# Altium schematic sheet ADC_4CH.SchDoc: ADC
size 420 x 297 mm; EDA_Number: Sinara; Projet: BaseMod; Author: G.Kasprowicz; CompanyName: WUT ISE; DrawnBy: G.Kasprowicz; Organization: WUT ISE; Address1: PW ISE; Address2: Nowowiejska 15/19 00-665 Warsaw; Address3: gkasprow@gmail.com; DocumentNumber: 3; Revision: 1.0; SheetNumber: 3; SheetTotal: 7; ModifiedBy: -; CheckedDate: -; Title2: & reference; DivGrp: WUT ISE; Designer: G.Kasprowicz; ModifiedDate: -; ProjectName: Sensor Box
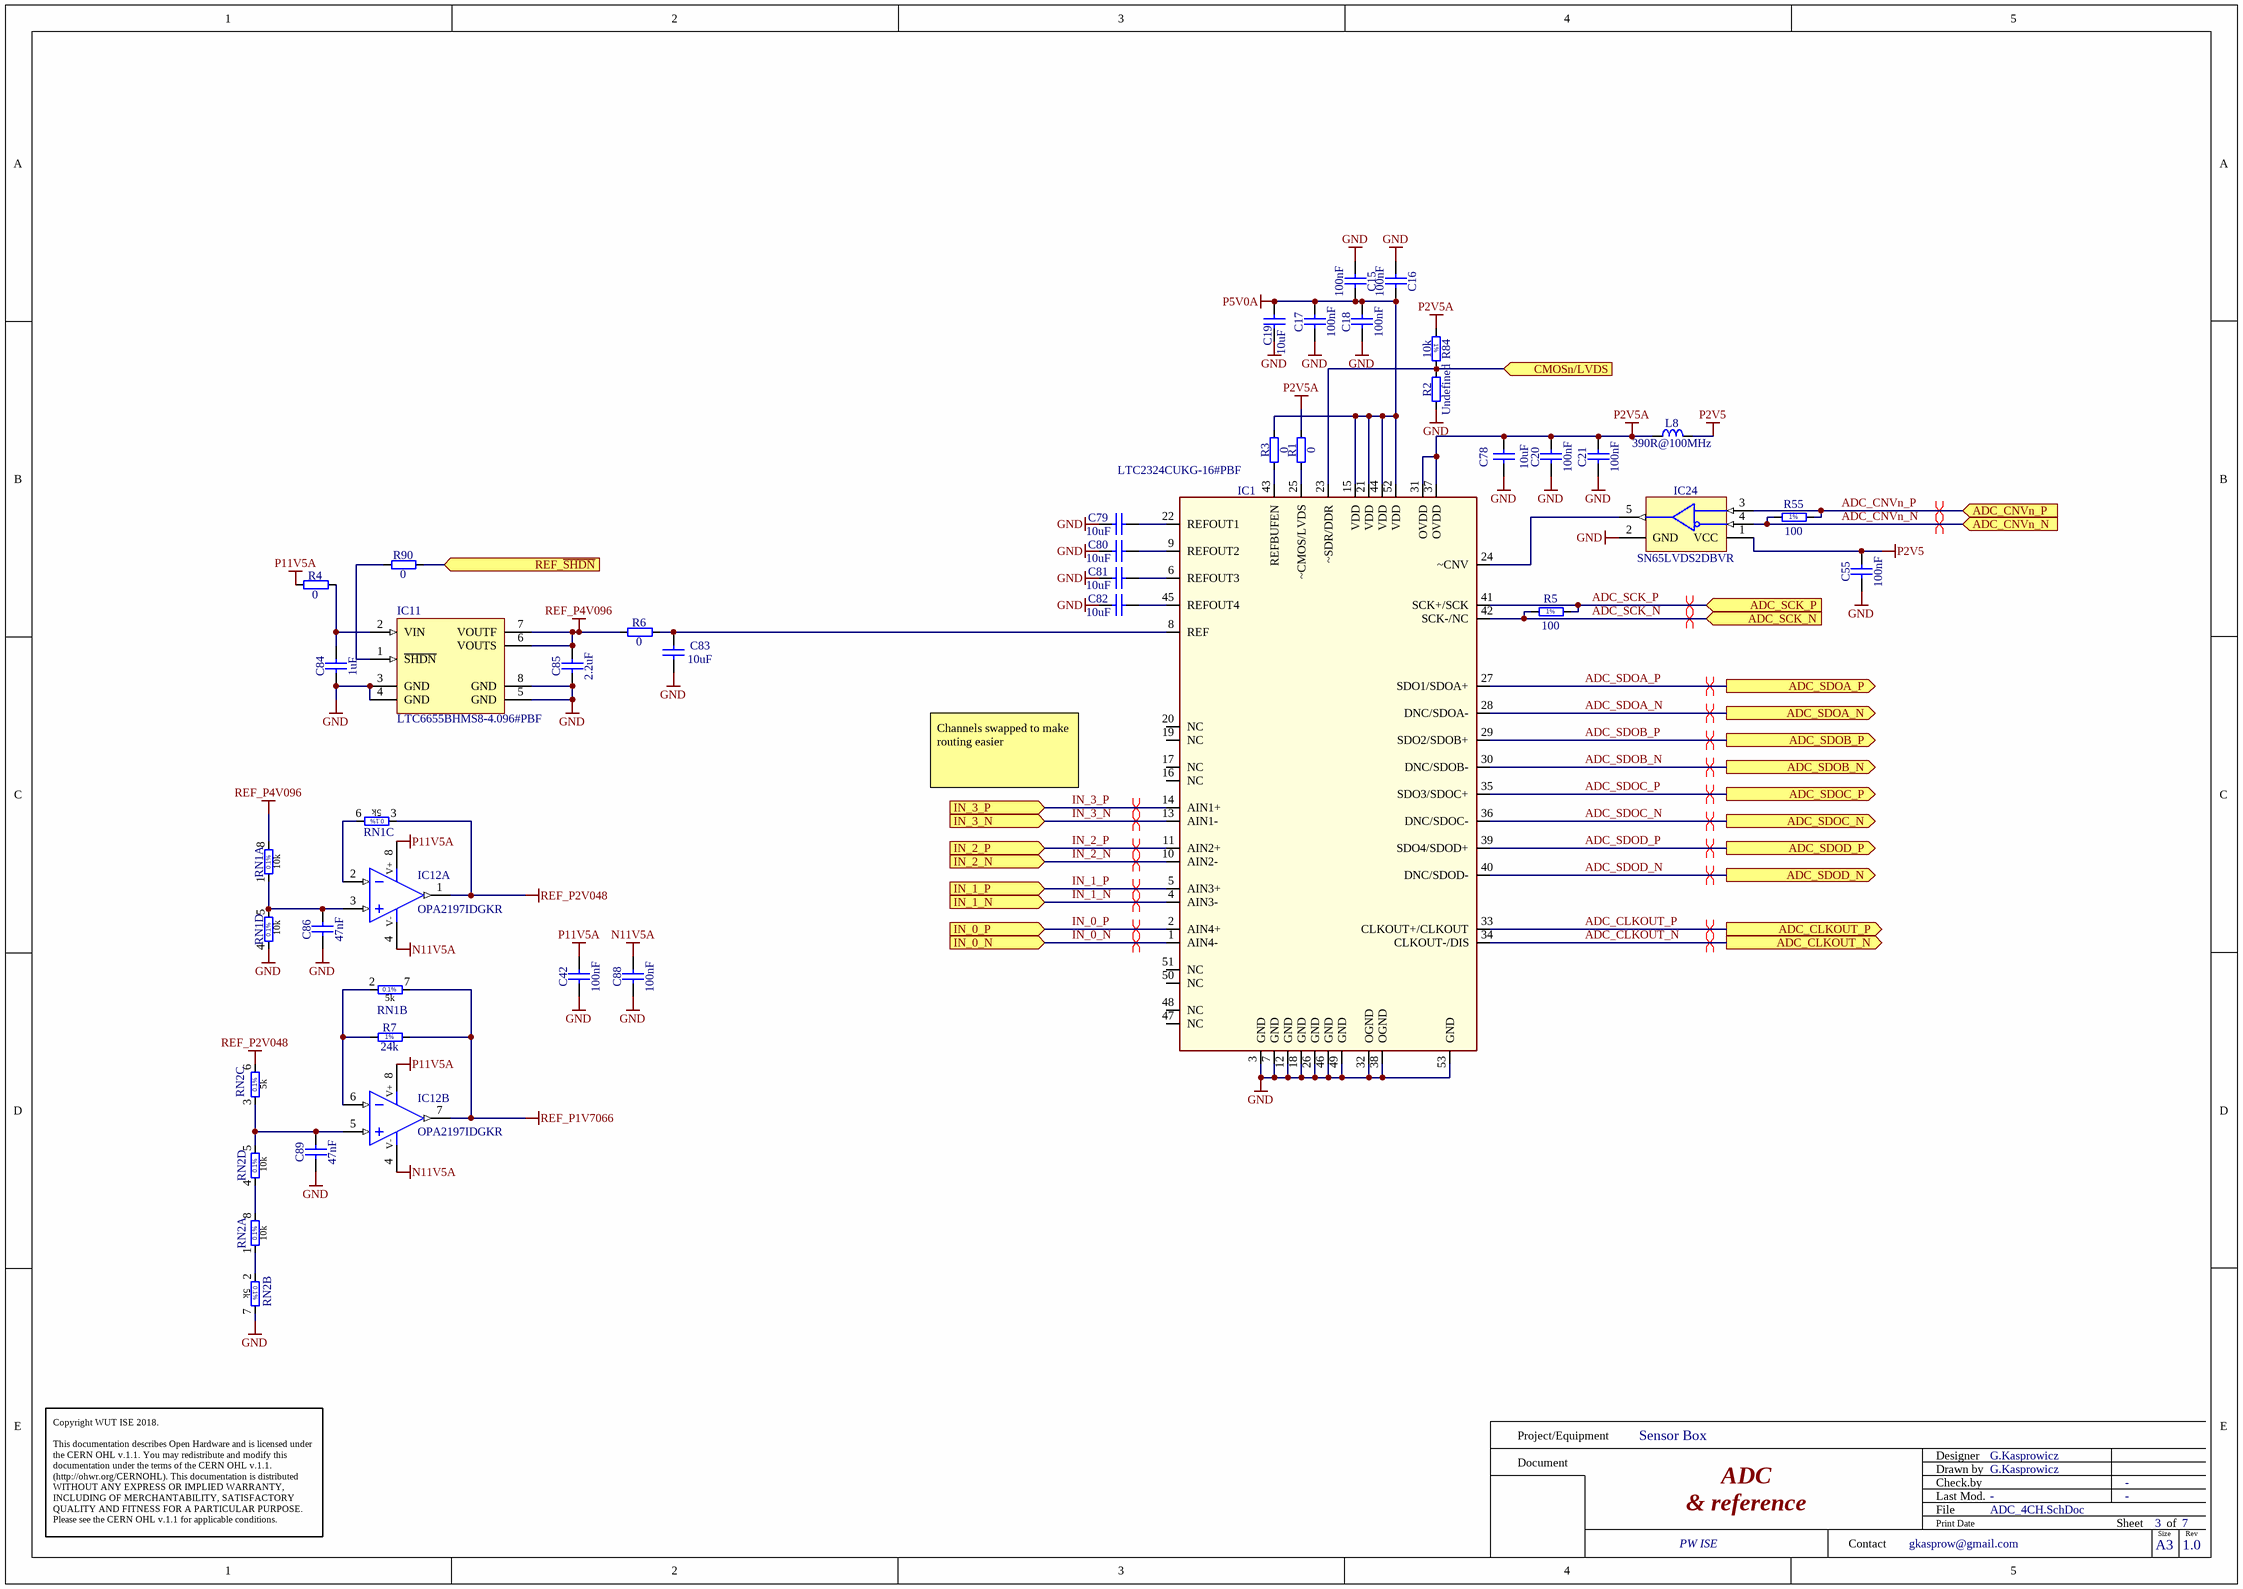
[diagram p0: ADC_4CH.SchDoc]

## Parts
C15  100nF  [CAPC1608X87N]
C16  100nF  [CAPC1608X87N]
C17  100nF  [CAPC1608X87N]
C18  100nF  [CAPC1608X87N]
C19  10uF  [CAPC2012X95N]
C20  100nF  [CAPC1608X87N]
C21  100nF  [CAPC1608X87N]
C42  100nF  [CAPC1005X55N]
C55  100nF  [CAPC1608X87N]
C78  10uF  [CAPC2012X95N]
C79  10uF  [CAPC2012X95N]
C80  10uF  [CAPC2012X95N]
C81  10uF  [CAPC2012X95N]
C82  10uF  [CAPC2012X95N]
C83  10uF  [CAPC2012X95N]
C84  1uF  [CAPC1608X87N]
C85  2.2uF  [CAPC1608X87N]
C86  47nF  [CAPC2012X135N]
C88  100nF  [CAPC1005X55N]
C89  47nF  [CAPC2012X135N]
IC1  LTC2324CUKG-16#PBF  [QFN50P700X800X80_HS-53M]
IC11  LTC6655BHMS8-4.096#PBF  [SOP65P490X110-8N]
IC12  OPA2197IDGKR  [SOP65P490X110-8N]  (parts A,B of 2)
IC24  SN65LVDS2DBVR  [SOT95P280X145-5N]
L8  390R@100MHz  [INDC1608X95N]
R1  0  [RESC1005X40N]
R2  Undefined  [RESC1005X40N]
R3  0  [RESC1005X40N]
R4  0  [RESC1005X40N]
R5  100  [RESC1005X40N]
R6  0  [RESC1005X40N]
R7  24k  [RESC1608X55N]
R55  100  [RESC1005X40N]
R84  10k  [RESC1005X40N]
R90  0  [RESC1005X40N]
RN1  10k 5K 5K 10K  [SOIC127P600X175-8N]  (value not drawn)  (parts A,B,C,D of 4)
RN2  10k 5K 5K 10K  [SOIC127P600X175-8N]  (value not drawn)  (parts A,B,C,D of 4)

## Ports
ADC_CLKOUT_N (out), ADC_CLKOUT_P (out), ADC_CNVn_N (in), ADC_CNVn_P (in), ADC_SCK_N (in), ADC_SCK_P (in), ADC_SDOA_N (out), ADC_SDOA_P (out), ADC_SDOB_N (out), ADC_SDOB_P (out), ADC_SDOC_N (out), ADC_SDOC_P (out), ADC_SDOD_N (out), ADC_SDOD_P (out), CMOSn/LVDS (in), IN_0_N (in), IN_0_P (in), IN_1_N (in), IN_1_P (in), IN_2_N (in), IN_2_P (in), IN_3_N (in), IN_3_P (in), REF_~{SHDN} (in)

## Nets
GND: C15.1 C16.1 C17.1 C18.1 C19.1 C20.1 C21.1 C42.1 C55.1 C78.1 C79.1 C80.1 C81.1 C82.1 C83.1 C84.1 C85.1 C86.1 C88.1 C89.1 IC1.3(GND) IC1.7(GND) IC1.12(GND) IC1.18(GND) IC1.26(GND) IC1.32(OGND) IC1.38(OGND) IC1.46(GND) IC1.49(GND) IC1.53(GND) IC11.3(GND) IC11.4(GND) IC11.5(GND) IC11.8(GND) IC24.2(GND) R2.1 RN1.4 RN2.7
N11V5A: C88.2 IC12.4(V-)
P2V5: C55.2 IC24.1(VCC) L8.2
P2V5A: C20.2 C21.2 C78.2 IC1.31(OVDD) IC1.37(OVDD) L8.1 R1.2 R84.1
P5V0A: C15.2 C16.2 C17.2 C18.2 C19.2 IC1.15(VDD) IC1.21(VDD) IC1.44(VDD) IC1.52(VDD) R3.2
P11V5A: C42.2 IC12.8(V+) R4.1
REF_P1V7066: IC12.7(OUT) R7.2 RN1.7
REF_P2V048: IC12.1(OUT) RN1.3 RN2.6
REF_P4V096: C85.2 IC11.6(VOUTS) IC11.7(VOUTF) R6.1 RN1.8
ADC_CLKOUT_N: IC1.34(CLKOUT-/DIS) ; port ADC_CLKOUT_N
ADC_CLKOUT_P: IC1.33(CLKOUT+/CLKOUT) ; port ADC_CLKOUT_P
ADC_CNVn_N: IC24.4(B) R55.1 ; port ADC_CNVn_N
ADC_CNVn_P: IC24.3(A) R55.2 ; port ADC_CNVn_P
ADC_SCK_N: IC1.42(SCK-/NC) R5.1 ; port ADC_SCK_N
ADC_SCK_P: IC1.41(SCK+/SCK) R5.2 ; port ADC_SCK_P
ADC_SDOA_N: IC1.28(DNC/SDOA-) ; port ADC_SDOA_N
ADC_SDOA_P: IC1.27(SDO1/SDOA+) ; port ADC_SDOA_P
ADC_SDOB_N: IC1.30(DNC/SDOB-) ; port ADC_SDOB_N
ADC_SDOB_P: IC1.29(SDO2/SDOB+) ; port ADC_SDOB_P
ADC_SDOC_N: IC1.36(DNC/SDOC-) ; port ADC_SDOC_N
ADC_SDOC_P: IC1.35(SDO3/SDOC+) ; port ADC_SDOC_P
ADC_SDOD_N: IC1.40(DNC/SDOD-) ; port ADC_SDOD_N
ADC_SDOD_P: IC1.39(SDO4/SDOD+) ; port ADC_SDOD_P
CMOSn/LVDS: IC1.23(~SDR/DDR) R2.2 R84.2 ; port CMOSn/LVDS
IN_0_N: IC1.1(AIN4-) ; port IN_0_N
IN_0_P: IC1.2(AIN4+) ; port IN_0_P
IN_1_N: IC1.4(AIN3-) ; port IN_1_N
IN_1_P: IC1.5(AIN3+) ; port IN_1_P
IN_2_N: IC1.10(AIN2-) ; port IN_2_N
IN_2_P: IC1.11(AIN2+) ; port IN_2_P
IN_3_N: IC1.13(AIN1-) ; port IN_3_N
IN_3_P: IC1.14(AIN1+) ; port IN_3_P
REF_~{SHDN}: R90.2 ; port REF_~{SHDN}
NetC79_2: C79.2 IC1.22(REFOUT1)
NetC80_2: C80.2 IC1.9(REFOUT2)
NetC81_2: C81.2 IC1.6(REFOUT3)
NetC82_2: C82.2 IC1.45(REFOUT4)
NetC83_2: C83.2 IC1.8(REF) R6.2
NetC84_2: C84.2 IC11.2(VIN) R4.2
NetC86_2: C86.2 IC12.3(IN+) RN1.1 RN1.5
NetC89_2: C89.2 IC12.5(IN+) RN2.3 RN2.5
NetIC1_24: IC1.24(~CNV) IC24.5(R)
NetIC1_25: IC1.25(~CMOS/LVDS) R1.1
NetIC1_43: IC1.43(REFBUFEN) R3.1
NetIC11_1: IC11.1(~{SHDN}) R90.1
NetIC12_2: IC12.2(IN-) RN1.6
NetIC12_6: IC12.6(IN-) R7.1 RN1.2
NetRN2_1: RN2.1 RN2.2
NetRN2_4: RN2.4 RN2.8

Not connected (* = marked no-connect by the designer): IC1 16(NC) 17(NC) 19(NC) 20(NC) 47(NC) 48(NC) 50(NC) 51(NC)

## Layout directives
differential pair: ADC_CLKOUT_N, ADC_CLKOUT_P, ADC_CNVn_N, ADC_CNVn_P, ADC_SCK_N, ADC_SCK_P, ADC_SDOA_N, ADC_SDOA_P, ADC_SDOB_N, ADC_SDOB_P, ADC_SDOC_N, ADC_SDOC_P, ADC_SDOD_N, ADC_SDOD_P, IN_0_N, IN_0_P, IN_1_N, IN_1_P, IN_2_N, IN_2_P, IN_3_N, IN_3_P

## Notes on the sheet
- Channels swapped to make routing easier
- Project/Equipment
- Document
- Designer
- Drawn by
- Check.by
- Copyright WUT ISE 2018.
  This documentation describes Open Hardware and is licensed under the CERN OHL v.1.1. You may redistribute and modify this documentation under the terms of the CERN OHL v.1.1. (http://ohwr.org/CERNOHL). This documentation is distributed WITHOUT ANY EXPRESS OR IMPLIED WARRANTY, INCLUDING OF MERCHANTABILITY, SATISFACTORY QUALITY AND FITNESS FOR A PARTICULAR PURPOSE. Please see the CERN OHL v.1.1 for applicable conditions.
- Contact
- File
- Last Mod.
- Print Date
- Sheet
- Size
- A3
- of
- Rev
- (in symbol R0402_10K_1%_0.0625W_100PPM) 1%
- (in symbol R0402_100R_1%_0.1W_100PPM) 1%
- (in symbol R0603_24K_1%_0.1W_100PPM) 1%
- (in symbol RN_10K_5K_VISHAY_AORN2-1AT3, part A) 10k
- (in symbol RN_10K_5K_VISHAY_AORN2-1AT3, part B) 5k
- (in symbol RN_10K_5K_VISHAY_AORN2-1AT3, part C) 5k
- (in symbol RN_10K_5K_VISHAY_AORN2-1AT3, part D) 10k

## Library data of the parts
C15-C18 C20 C21 C55 = CC0603_100NF_50V_10%_X7R: Non-polarised capacitor; Part Description: SMD Multilayer Chip Ceramic Capacitor; Manufacturer: GENERIC; Manufacturer1 Part Number: 223858615649; Voltage: 50V; TC: X7R; Tolerance: ±10%; Part Number: CC0603_100NF_50V_10%_X7R; Component Kind: Standard; Component Type: Standard; Pin Count: 2; Value: 100nF; Status: Preferred; Manufacturer Part Number: CC0603_100NF_50V_10%_X7R; Case: 0603; Mounted: Yes; Socket: No; SMD: Yes; Sense: No; Manufacturer1 Example: PHYCOMP; Manufacturer1 ComponentHeight: 0.87mm; HelpURL: \\cern.ch\dfs\Applications\Altium\Datasheets\CC0603_X7R_PHYCOMP.pdf; Author: CERN DEM JLC; CreateDate: 03.12.2007; LatestRevisionDate: 03.12.2007
C19 C78-C83 = CC0805_10UF_25V_10%_X5R: Non-polarised capacitor; Part Description: SMD Multilayer Chip Ceramic Capacitor; Manufacturer: GENERIC; Manufacturer1 Part Number: GRM219R61E106KA12D; Voltage: 25V; TC: X5R; Tolerance: ±10%; Part Number: CC0805_10UF_25V_10%_X5R; Component Kind: Standard; Component Type: Standard; Pin Count: 2; Value: 10uF; Status: Preferred; Manufacturer Part Number: CC0805_10UF_25V_10%_X5R; Case: 0805; Mounted: Yes; Socket: No; SMD: Yes; Sense: No; Manufacturer1 Example: MURATA; Manufacturer1 ComponentHeight: 0.95mm; HelpURL: \\cern.ch\dfs\Applications\Altium\Datasheets\CC0805_X5R_MURATA_GRM.pdf; Author: CERN DEM JLC; CreateDate: 25.10.2012; LatestRevisionDate: 06.09.2016
C42 C88 = CC0402_100NF_16V_10%_X5R: Non-polarised capacitor; Part Description: SMD Multilayer Chip Ceramic Capacitor; Manufacturer: GENERIC; Manufacturer1 Part Number: GRM155R61C104KA88D; Voltage: 16V; TC: X5R; Tolerance: ±10%; Part Number: CC0402_100NF_16V_10%_X5R; Component Kind: Standard; Component Type: Standard; Pin Count: 2; Value: 100nF; Status: None; Manufacturer Part Number: CC0402_100NF_16V_10%_X5R; Case: 0402; Mounted: Yes; Socket: No; SMD: Yes; Sense: No; Manufacturer1 Example: MURATA; Manufacturer1 ComponentHeight: 0.55mm; HelpURL: \\cern.ch\dfs\Applications\Altium\Datasheets\CC0402_X5R_MURATA_GRM.pdf; Author: CERN DEM JLC; CreateDate: 10.12.2013; LatestRevisionDate: 10.12.2013
C84 = CC0603_1UF_25V_10%_X7R: Non-polarised capacitor; Part Description: SMD Multilayer Chip Ceramic Capacitor; Manufacturer: GENERIC; Manufacturer1 Part Number: GRM188R71E105KA12D; Voltage: 25V; TC: X7R; Tolerance: ±10%; Part Number: CC0603_1UF_25V_10%_X7R; Component Kind: Standard; Component Type: Standard; Pin Count: 2; Value: 1uF; Status: None; Manufacturer Part Number: CC0603_1UF_25V_10%_X7R; Case: 0603; Mounted: Yes; Socket: No; SMD: Yes; Sense: No; Manufacturer1 Example: MURATA; Manufacturer1 ComponentHeight: 0.9mm; HelpURL: \\cern.ch\dfs\Applications\Altium\Datasheets\CC0603_X7R_MURATA.pdf; Author: CERN DEM JLC; CreateDate: 18.01.2011; LatestRevisionDate: 18.01.2011
C85 = CC0603_2.2UF_16V_10%_X5R: Non-polarised capacitor; Part Description: SMD Multilayer Chip Ceramic Capacitor; Manufacturer: GENERIC; Manufacturer1 Part Number: CC0603KRX5R7BB225; Voltage: 16V; TC: X5R; Tolerance: ±10%; Part Number: CC0603_2.2UF_16V_10%_X5R; Component Kind: Standard; Component Type: Standard; Pin Count: 2; Value: 2.2uF; Status: Preferred; Manufacturer Part Number: CC0603_2.2UF_16V_10%_X5R; Case: 0603; Mounted: Yes; Socket: No; SMD: Yes; Sense: No; Manufacturer1 Example: YAGEO; Manufacturer1 ComponentHeight: 0.9mm; HelpURL: \\cern.ch\dfs\Applications\Altium\Datasheets\CC0805_X5R_PHYCOMP_HC.pdf; Author: CERN DEM JLC; CreateDate: 28.04.2011; LatestRevisionDate: 28.04.2011
C86 C89 = CC0805_47NF_25V_5%_C0G: Non-polarised capacitor; Part Description: SMD Multilayer Chip Ceramic Capacitor; Manufacturer: GENERIC; Manufacturer1 Part Number: C0805C473J3GACTU; Voltage: 25V; TC: C0G/NP0; Tolerance: ±5%; Part Number: CC0805_47NF_25V_5%_C0G; Component Kind: Standard; Component Type: Standard; Pin Count: 2; Value: 47nF; Status: None; Manufacturer Part Number: CC0805_47NF_25V_5%_C0G; Case: 0805; Mounted: Yes; Socket: No; SMD: Yes; Sense: No; Manufacturer1 Example: KEMET; Manufacturer1 ComponentHeight: 1.4mm; HelpURL: \\cern.ch\dfs\Applications\Altium\Datasheets\CC0805_C0G_KEMET_(Commercial Grade).pdf; Author: CERN DEM JLC; CreateDate: 18.01.2011; LatestRevisionDate: 18.01.2011
IC1 = ADC_LTC2324CUKG-16: Quad, 16-Bit, 2Msps/Ch  Simultaneous Sampling ADC; Manufacturer: LINEAR TECHNOLOGY; PressFit: No; Bonding: No; Part Number: LTC2324CUKG-16#PBF; Component Kind: Standard; Component Type: Standard; Device: LTC2324CUKG-16#PBF; PackageDescription: QFN, 52-Leads, Body 7.00x8.00mm, Pitch 0.50mm, Thermal Pad 5.41x6.40mm, IPC Low Density; Part Description: Quad, 16-Bit, 2Msps/Ch  Simultaneous Sampling ADC; Manufacturer Part Number: LTC2324CUKG-16#PBF; Pin Count: 48; Case: QFP48; Mounted: Yes; Socket: No; SMD: Yes; Sense: No; ComponentHeight: 0.8; Author: GK; HelpURL: \\cern.ch\dfs\Applications\Altium\Datasheets\LTC2335CLX-18#PBF.pdf; CreateDate: 10.01.2017; LatestRevisionDate: 10.01.2017
IC11 = REF_LTC6655: 0.25ppm Noise, Low Drift Precision Buffered Voltage Reference; Part Description: 4.096V, 0.25ppm Noise, Low Drift Precision Buffered Voltage Reference; Manufacturer: LINEAR TECHNOLOGY; PressFit: No; Bonding: No; Part Number: LTC6655BHMS8-4.096#PBF; Component Kind: Standard; Component Type: Standard; Device: LTC6655BHMS8-4.096#PBF; PackageDescription: SOP, 8-Leads, Body 3.1x3.1mm (max), Pitch 0.65mm, IPC Medium Density; Manufacturer Part Number: LTC6655BHMS8-4.096#PBF; Pin Count: 8; Case: SSOP8; Mounted: Yes; Socket: No; SMD: Yes; Sense: No; ComponentHeight: 1.1mm; HelpURL: \\cern.ch\dfs\Applications\Altium\Datasheets\LTC6655BHMS8-5#PBF.pdf; Author: GK; CreateDate: 07.06.2012; LatestRevisionDate: 07.06.2012
IC12 = OA_OPA2197IDGKR: 36-V, Precision, Rail-to-Rail Input Output, Low Offset Voltage Op Amp 8-VSSOP; Part Description: High-Precision, Low-Noise, Rail-to-Rail Output,10-MHz Op Amp; Manufacturer: TEXAS INSTRUMENTS; PressFit: No; Bonding: No; Part Number: OPA2197IDGKR; Component Kind: Standard; Component Type: Standard; Device: OPA2197IDGKR; PackageDescription: SOP, 0.65mm pitch; 8 pin, 3.00mm W X 3.00mm L X 1.10mm H body, IPC Medium Density; Manufacturer Part Number: OPA2197IDGKR; Pin Count: 8; Case: MSOP8; Mounted: Yes; Socket: No; SMD: Yes; Sense: No; ComponentHeight: 1.1mm; Author: GK; HelpURL: \\cern.ch\dfs\Applications\Altium\Datasheets\OPA2140AIDGK.pdf; CreateDate: 20.04.2017; LatestRevisionDate: 20.04.2017
IC24 = SN65LVDS2DBVR: High-Speed Differential Line Receiver; Manufacturer: TEXAS INSTRUMENTS; PressFit: No; Bonding: No; Part Number: SN65LVDS2DBVR; Component Kind: Standard; Component Type: Standard; Device: SN65LVDS2DBVR; PackageDescription: SOT, 0.95mm pitch; 5 pin, 1.60mm W X 2.90mm L X 1.45mm H body, IPC Medium Density; Part Description: High-Speed Differential Line Receiver; Manufacturer Part Number: SN65LVDS2DBVR; Pin Count: 5; Case: SOT23-5; Mounted: Yes; Socket: No; SMD: Yes; Sense: No; ComponentHeight: 1.45mm; Author: CERN DEM JLC; HelpURL: \\cern.ch\dfs\Applications\Altium\Datasheets\SN65LVDS2DBVR.pdf; CreateDate: 03.03.2011; LatestRevisionDate: 22.09.2011
L8 = IND0603_TDK_MPZ1608R391A: Inductor; Part Description: SMT Chip Bead for Power Line; Manufacturer: TDK; Power: 1.2A; Resistance: 0.12R; Tolerance: ±25%; Part Number: IND0603_TDK_MPZ1608R391A; Component Kind: Standard; Component Type: Standard; Pin Count: 2; Value: 390R@100MHz; Status: None; Manufacturer Part Number: MPZ1608R391A; Case: 0603; Mounted: Yes; Socket: No; SMD: Yes; Sense: No; ComponentHeight: 0.95mm; HelpURL: \\cern.ch\dfs\Applications\Altium\Datasheets\IND0603_TDK_MPZ1608.pdf; Author: CERN DEM JLC; CreateDate: 2009-12-02; LatestRevisionDate: 2009-12-02
R1 R3 R4 R6 R90 = R0402_0R_JUMPER: Resistor; Part Description: 1A (0.05R Max DC Resistance) Zero Ohm Jumper; Manufacturer: GENERIC; Manufacturer1 Part Number: 232270591001L; Part Number: R0402_0R_JUMPER; Component Kind: Standard; Component Type: Standard; Pin Count: 2; Value: 0; Status: Not recommended; Manufacturer Part Number: R0402_0R_JUMPER; Case: 0402; Mounted: Yes; Sense: No; Socket: No; SMD: Yes; Manufacturer1 Example: YAGEO PHYCOMP; Manufacturer1 ComponentHeight: 0.4mm; HelpURL: \\cern.ch\dfs\Applications\Altium\Datasheets\R0402_Phycomp_RC0402.pdf; Author: CERN DEM JLC; CreateDate: 03.12.2007; LatestRevisionDate: 17.10.2012
R2 = R0402_NO-VALUE: Resistor; Part Description: Reserved Footprint For a 0402 (1005) Chip Resistor; PressFit: No; Mounted: No; Part Number: R0402_NO-VALUE; Component Kind: Standard; Component Type: Standard; Pin Count: 2; Value: Undefined; Status: None; Manufacturer: Undefined; Manufacturer Part Number: R0402_NO-VALUE; Case: 0402; Sense: No; Socket: No; SMD: Yes; Manufacturer1 Example: Undefined; Manufacturer1 Part Number: Undefined; Manufacturer1 ComponentHeight: Undefined; HelpURL: Undefined; Author: CERN DEM JLC; CreateDate: 03.12.2007; LatestRevisionDate: 13.03.2008
R5 R55 = R0402_100R_1%_0.1W_100PPM: Resistor - 1%; Part Description: General Purpose Thick Film Chip Resistor; Manufacturer: GENERIC; Manufacturer Part Number: R0402_100R_1%_0.1W_100PPM_50V; Manufacturer1 Part Number: ERJ2RKF1000X; Power: 0.1W; TC: ±100ppm/°C; Voltage: 50V; Part Number: R0402_100R_1%_0.1W_100PPM; Component Kind: Standard; Component Type: Standard; Pin Count: 2; Value: 100; Status: Not recommended; Tolerance: ±1%; Case: 0402; Mounted: Yes; Sense: No; Socket: No; SMD: Yes; Manufacturer1 Example: PANASONIC; Manufacturer1 ComponentHeight: 0.4mm; HelpURL: \\cern.ch\dfs\Applications\Altium\Datasheets\R0402_PANASONIC_ERJ2RK.pdf; Author: CERN DEM JLC; CreateDate: 12.12.2013; LatestRevisionDate: 03.03.2015
R7 = R0603_24K_1%_0.1W_100PPM: Resistor - 1%; Part Description: General Purpose Thick Film Chip Resistor; Manufacturer: GENERIC; Manufacturer1 Part Number: NRC06F2402TRF; Power: 0.1W; TC: ±100ppm/°C; PressFit: No; Part Number: R0603_24K_1%_0.1W_100PPM; Component Kind: Standard; Component Type: Standard; Pin Count: 2; Value: 24k; Status: Preferred; Tolerance: ±1%; Manufacturer Part Number: R0603_24K_1%_0.1W_100PPM; Case: 0603; Mounted: Yes; Sense: No; Socket: No; SMD: Yes; Manufacturer1 Example: NIC COMPONENT; Manufacturer1 ComponentHeight: 0.55mm; HelpURL: \\cern.ch\dfs\Applications\Altium\Datasheets\R0603_NIC_NRC.pdf; Author: CERN DEM JLC; CreateDate: 03.12.2007; LatestRevisionDate: 13.03.2008
R84 = R0402_10K_1%_0.0625W_100PPM: Resistor - 1%; Part Description: General Purpose Thick Film Chip Resistor; Manufacturer: GENERIC; Manufacturer1 Part Number: 232270671003L; TC: ±100ppm/°C; Part Number: R0402_10K_1%_0.0625W_100PPM; Component Kind: Standard; Component Type: Standard; Pin Count: 2; Value: 10k; Status: Not recommended; Power: 0.0625W; Tolerance: ±1%; Manufacturer Part Number: R0402_10K_1%_0.0625W_100PPM; Case: 0402; Mounted: Yes; Sense: No; Socket: No; SMD: Yes; Manufacturer1 Example: YAGEO PHYCOMP; Manufacturer1 ComponentHeight: 0.4mm; HelpURL: \\cern.ch\dfs\Applications\Altium\Datasheets\R0402_Phycomp_RC0402.pdf; Author: CERN DEM JLC; CreateDate: 03.12.2007; LatestRevisionDate: 17.10.2012
RN1 RN2 = RN_10K_5K_VISHAY_AORN2-1AT3: DIL8 Resistor Network 4 Resistors 10k-5k-5k-10k 0.1%; Part Description: Dual-In-Line Thin Film Precision Automotive Resistors Network, (4 Isolated) - AORN Series; Manufacturer: VISHAY DALE; Power: 4x0.1W; TC: ±25ppm/°C; PressFit: No; Part Number: RN_10K_5K_VISHAY_AORN2-1AT3; Component Kind: Standard; Component Type: Standard; Pin Count: 8; Value: 10k 5K 5K 10K; Sense: No; Tolerance: 0.1%; Manufacturer Part Number: AORN2-1AT3; Case: SOIC8; Mounted: Yes; Socket: No; SMD: Yes; ComponentHeight: 1.73mm; HelpURL: \\cern.ch\dfs\Applications\Altium\Datasheets\RN_VISHAY_AORN.pdf; Author: CERN DEM JLC; CreateDate: 20.02.2017; LatestRevisionDate: 20.02.2017